# EAGLE design pov (EAGLE 5.11)
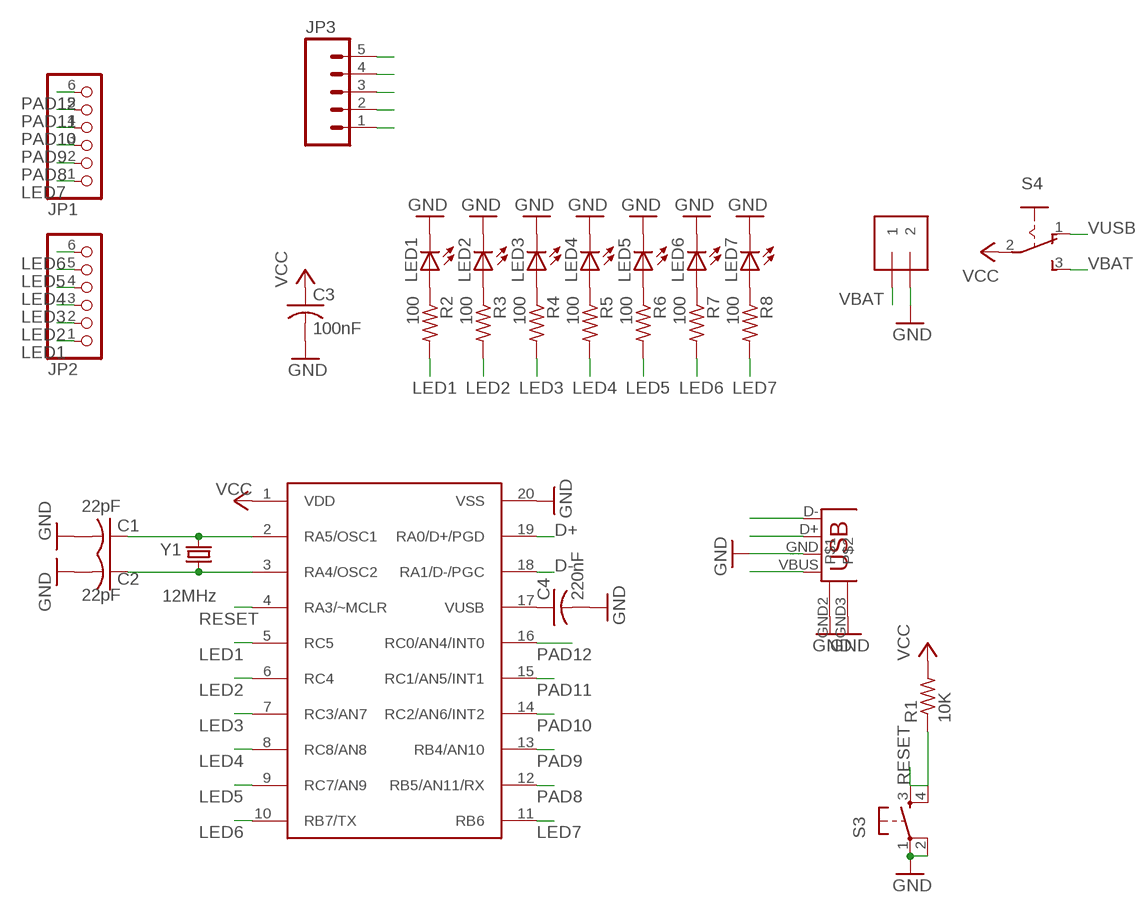
[diagram p0: schematic, sheet 1]

## Parts
C1  22pF  C-US025-025X050  [C025-025X050]
C2  22pF  C-US025-025X050  [C025-025X050]
C3  100nF  C-US025-025X050  [C025-025X050]
C4  220nF  C-US025-025X050  [C025-025X050]
J1  1X2-3.5MM  [1X2-3.5MM]
JP1  PINHD-1X6B  [1X06-BIG]
JP2  PINHD-1X6B  [1X06-BIG]
JP3  M05PTH  [1X05]
LED1  LED5MM  [LED5MM]
LED2  LED5MM  [LED5MM]
LED3  LED5MM  [LED5MM]
LED4  LED5MM  [LED5MM]
LED5  LED5MM  [LED5MM]
LED6  LED5MM  [LED5MM]
LED7  LED5MM  [LED5MM]
R1  10K  R-US_0204/7  [0204/7]
R2  100  R-US_0204/5  [0204/5]
R3  100  R-US_0204/5  [0204/5]
R4  100  R-US_0204/5  [0204/5]
R5  100  R-US_0204/5  [0204/5]
R6  100  R-US_0204/5  [0204/5]
R7  100  R-US_0204/5  [0204/5]
R8  100  R-US_0204/5  [0204/5]
S3  TAC_SWITCHPTH  [TACTILE-PTH]
S4  255SB  [255SB]
U$1  PIC18F14K50  [DIL20]
X1  USB-A-H  [USB-A-H]
Y1  12MHz  CRYSTALHC49UV  [HC49U-V]

## Nets
D+: JP3.2 U$1.19(RA0/D+/PGD) X1.D+(D-)
D-: JP3.1 U$1.18(RA1/D-/PGC) X1.D-(D+)
GND: C1.2 C2.2 C3.2 C4.2 J1.2 JP3.3 LED1.K(C) LED2.K(C) LED3.K(C) LED4.K(C) LED5.K(C) LED6.K(C) LED7.K(C) S3.1 S3.2 U$1.20(VSS) X1.GND2 X1.GND3 X1.GND(VBUS)
LED1: JP2.1 R2.2 U$1.5(RC5)
LED2: JP2.2 R3.2 U$1.6(RC4)
LED3: JP2.3 R4.2 U$1.7(RC3/AN7)
LED4: JP2.4 R5.2 U$1.8(RC8/AN8)
LED5: JP2.5 R6.2 U$1.9(RC7/AN9)
LED6: JP2.6 R7.2 U$1.10(RB7/TX)
LED7: JP1.1 R8.2 U$1.11(RB6)
N$1: C1.1 U$1.2(RA5/OSC1) Y1.2
N$2: C2.1 U$1.3(RA4/OSC2) Y1.1
N$3: C4.1 U$1.17(VUSB)
N$4: LED1.A R2.1
N$5: LED2.A R3.1
N$6: LED3.A R4.1
N$7: LED4.A R5.1
N$8: LED5.A R6.1
N$9: LED6.A R7.1
N$10: LED7.A R8.1
PAD8: JP1.2 U$1.12(RB5/AN11/RX)
PAD9: JP1.3 U$1.13(RB4/AN10)
PAD10: JP1.4 U$1.14(RC2/AN6/INT2)
PAD11: JP1.5 U$1.15(RC1/AN5/INT1)
PAD12: JP1.6 U$1.16(RC0/AN4/INT0)
RESET: JP3.5 R1.1 S3.3 S3.4 U$1.4(RA3/~MCLR)
VBAT: J1.1 S4.3(S)
VCC: C3.1 JP3.4 R1.2 S4.2(P) U$1.1(VDD)
VUSB: S4.1(O) X1.VBUS(GND)

## Library data of the parts
C1-C4 = adafruit:C-US: CAPACITOR, American symbol
J1 = adafruit:1X2: 3.5mm Terminal block http://www.ladyada.net/library/pcb/eaglelibrary.html
JP1 JP2 = adafruit:PINHD-1X6: PIN HEADER
JP3 = SparkFun:M05: Header 5 Standard 5-pin 0.1" header. Use with straight break away headers (SKU : PRT-00116), right angle break away headers (PRT-00553), swiss pins (PRT-00743), machine pins (PRT-00117), and female headers (PRT-00115). Molex polarized connector foot print use with SKU : PRT-08230 with associated crimp pins and housings.
LED1-LED7 = adafruit:LED: LED OSRAM: - CHIPLED LG R971, LG N971, LY N971, LG Q971, LY Q971, LO R971, LY R971 LH N974, LH R974 LS Q976, LO Q976, LY Q976 LO Q996 - Hyper CHIPLED LW Q18S LB Q993, LB Q99A, LB R99A - SideLED LS A670, LO A670, LY A670, LG A670, LP A670 LB A673, LV A673, LT A673, LW A673 LH A674 LY A675 LS A676, LA A676, LO A676, LY A676, LW A676 LS A679, LY A679, LG A679 - Hyper Micro SIDELED® LS Y876, LA Y876, LO Y876, LY Y876 LT Y87S - SmartLED LW L88C, LW L88S LB L89C, LB L89S, LG L890 LS L89K, LO L89K, LY L89K LS L896, LA L896, LO L896, LY L896 - TOPLED LS T670, LO T670, LY T670, LG T670, LP T670 LSG T670, LSP T670, LSY T670, LOP T670, LYG T670 LG T671, LOG T671, LSG T671 LB T673, LV T673, LT T673, LW T673 LH T674 LS T676, LA T676, LO T676, LY T676, LB T676, LH T676, LSB T676, LW T676 LB T67C, LV T67C, LT T67C, LS T67K, LO T67K, LY T67K, LW E67C LS E67B, LA E67B, LO E67B, LY E67B, LB E67C, LV E67C, LT E67C LW T67C LS T679, LY T679, LG T679 LS T770, LO T770, LY T770, LG T770, LP T770 LB T773, LV T773, LT T773, LW T773 LH T774 LS E675, LA E675, LY E675, LS T675 LS T776, LA T776, LO T776, LY T776, LB T776 LHGB T686 LT T68C, LB T68C - Hyper Mini TOPLED® LB M676 - Mini TOPLED Santana® LG M470 LS M47K, LO M47K, LY M47K Source: http://www.osram.convergy.de/
R1-R8 = adafruit:R-US_: RESISTOR, American symbol
S3 = SparkFun:TAC_SWITCH: Momentary Switch Button commonly used for reset or general input. Spark Fun Electronics SKU : COM-00097
S4 = switch:255SB: SLIDING SWITCH Distributor Buerklin, 11G810
U$1 = pedrodiogo:PIC18F14K50: Microchip PIC18F14K50 DATASHEET: http://ww1.microchip.com/downloads/en/DeviceDoc/41350E.pdf
X1 = pedrodiogo:USB: USB Connectors USB-B-PTH is fully proven SKU : PRT-00139 USB-miniB is fully proven SKU : PRT-00587 USB-A-PCB is untested. USB-A-H is throughly reviewed, but untested. Spark Fun Electronics SKU : PRT-00437 USB-B-SMT is throughly reviewed, but untested. Needs silkscreen touching up. USB-A-S has not been used/tested USB-MB-H has not been used/tested
Y1 = SparkFun:CRYSTAL: Crystals Various standard crystals. Proven footprints. Spark Fun Electronics SKU : COM-00534

## Board
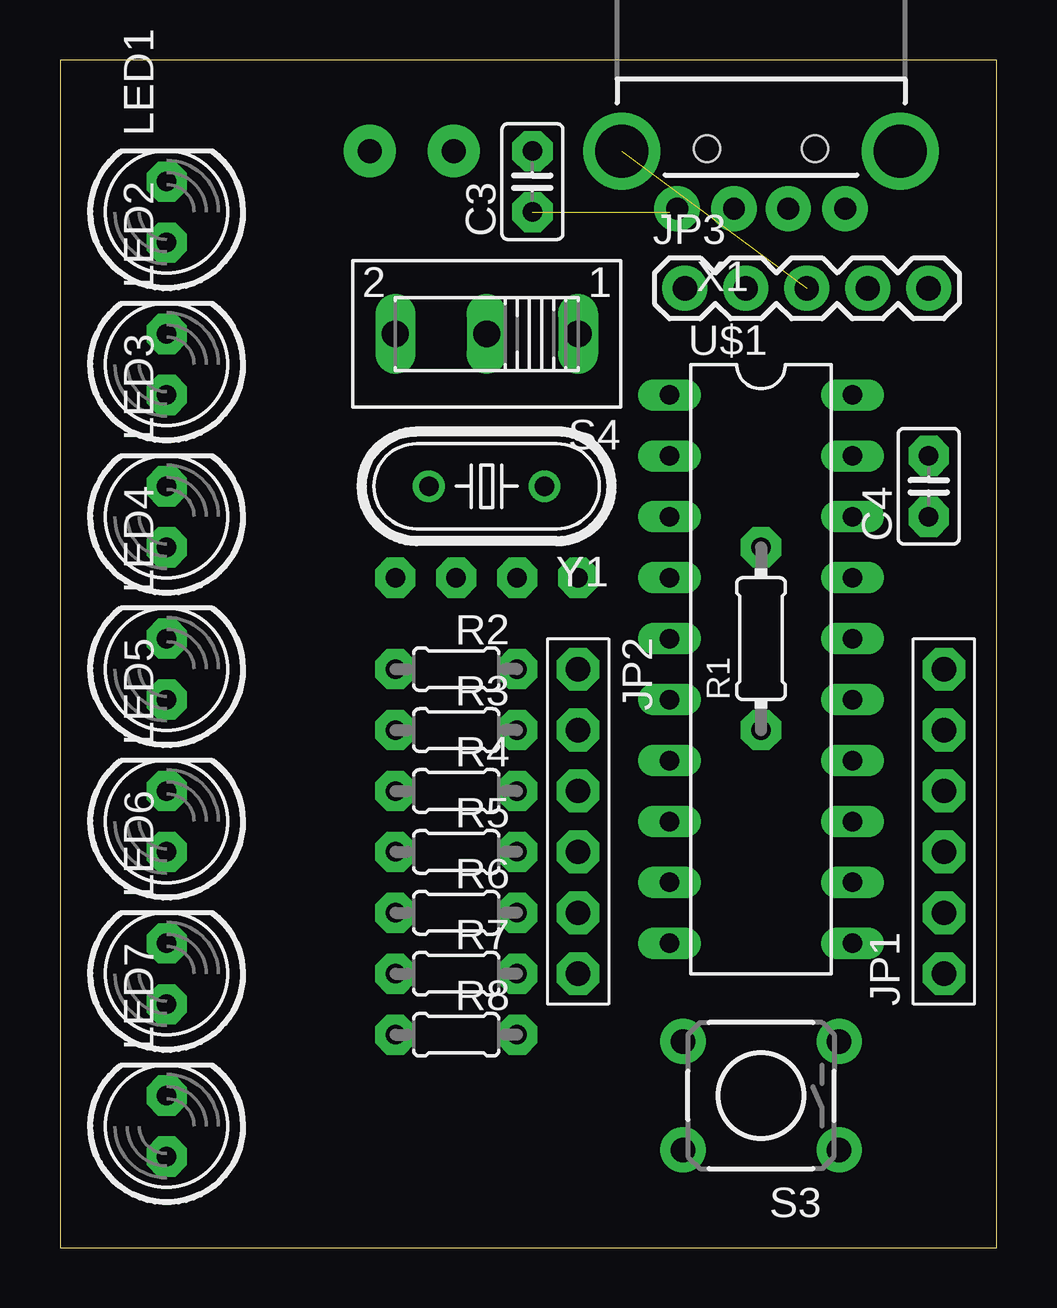
[diagram p1: board, top side]
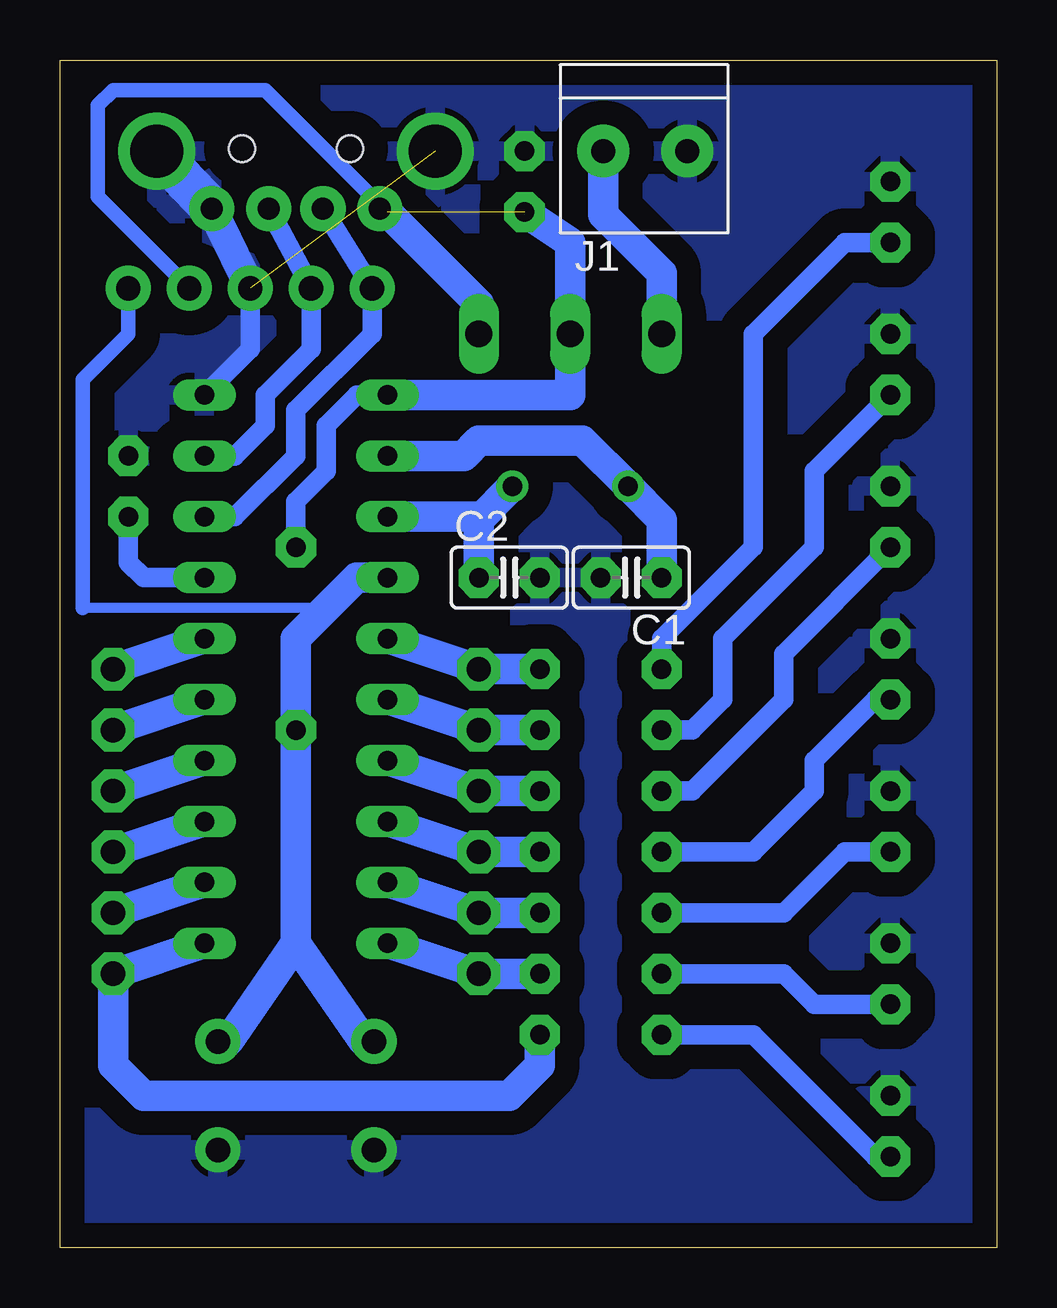
[diagram p2: board, bottom side, seen from below]

Size 39.04 x 49.52 mm. Coordinates in mm from the lower left corner, seen from the top.
Outline: 0,0 39.04,0 39.04,49.52 0,49.52 0,0
Copper layers (1*16): Top 0.035mm / dielectric 1.5mm / Bottom 0.035mm
Design rules "default *": minimum track width 16mil, minimum drill 24mil, track to track 40mil, track to pad 18mil, pad to pad 12mil, via to via 8mil, smd to smd 8mil, copper to edge 40mil, drill to drill 8mil, minimum pad ring 10mil, minimum via ring 8mil, stop-mask expansion 4mil, vias tented up to drill 0mil, thermal gap 10mil

### Footprints (pad centres in the part's own frame; a part is rotated, then mirrored left to right if it is on the bottom)
C025-025X050 = drill 0.813 pad 1.676 octagon: 1 -1.27,0; 2 1.27,0
1X2-3.5MM = drill 1 pad 2.184 round: 1 1.8,0; 2 -1.7,0
1X06-BIG = drill 1.016 pad 1.778 octagon: 1 -6.35,0; 2 -3.81,0; 3 -1.27,0; 4 1.27,0; 5 3.81,0; 6 6.35,0
1X05 = drill 1.016 pad 1.88 round: 1 0,0; 2 2.54,0; 3 5.08,0; 4 7.62,0; 5 10.16,0
LED5MM = drill 0.813 pad 1.676 octagon: A -1.27,0; K 1.27,0
0204/7 = drill 0.813 pad 1.676 octagon: 1 -3.81,0; 2 3.81,0
0204/5 = drill 0.813 pad 1.676 octagon: 1 -2.54,0; 2 2.54,0
TACTILE-PTH = drill 1.016 pad 1.88 round: 1 -3.251,2.261; 2 3.251,2.261; 3 -3.251,-2.261; 4 3.251,-2.261
255SB = drill 1.118 long: 1 -3.81,0; 2 0,0; 3 3.81,0
DIL20 = drill 0.813 long: 1 -11.43,-3.81; 2 -8.89,-3.81; 3 -6.35,-3.81; 4 -3.81,-3.81; 5 -1.27,-3.81; 6 1.27,-3.81; 7 3.81,-3.81; 8 6.35,-3.81; 9 8.89,-3.81; 10 11.43,-3.81; 11 11.43,3.81; 12 8.89,3.81; 13 6.35,3.81; 14 3.81,3.81; 15 1.27,3.81; 16 -1.27,3.81; 17 -3.81,3.81; 18 -6.35,3.81; 19 -8.89,3.81; 20 -11.43,3.81
USB-A-H = drill 0.914 pad 1.88 round: D+ 2.4,1.127; D- 2.4,-1.127; GND 2.4,3.5; VBUS 2.4,-3.5 | drill 2.2 round: GND2 0,-5.8; GND3 0,5.8 | hole 1.1: -0.1,2.25; -0.1,-2.25
HC49U-V = drill 0.813 round: 1 -2.413,0; 2 2.413,0

### Placement (x,y rotation side)
C1  15.24,27.94 180 bottom
C2  20.32,27.94 0 bottom
C3  19.68,44.45 90 top
C4  36.2,31.75 90 top
J1  14.61,45.72 180 bottom
JP1  36.83,17.78 90 top
JP2  21.59,17.78 270 top
JP3  26.04,40 0 top
LED1  4.45,43.18 90 top
LED2  4.45,36.83 90 top
LED3  4.45,30.48 90 top
LED4  4.45,24.13 90 top
LED5  4.45,17.78 90 top
LED6  4.45,11.43 90 top
LED7  4.45,5.08 90 top
R1  29.21,25.4 90 top
R2  16.51,24.13 0 top
R3  16.51,21.59 0 top
R4  16.51,19.05 0 top
R5  16.51,16.51 0 top
R6  16.51,13.97 0 top
R7  16.51,11.43 0 top
R8  16.51,8.89 0 top
S3  29.21,6.35 180 top
S4  17.78,38.1 180 top
U$1  29.21,24.13 270 top
X1  29.21,45.72 270 top
Y1  17.78,31.75 180 top

### Tracks (layer width: path | path; a pad name or v marks a point on that pad's centre or on a via)
D+
  Bottom 0.813: X1.D+ JP3.2 28.57,37.46 30.48,35.56 30.48,34.29 31.75,33.02 U$1.19
D-
  Bottom 0.813: X1.D- JP3.1 26.04,38.1 29.21,34.92 29.21,33.02 31.75,30.48 U$1.18
GND  (1 unrouted)
  Bottom 0.813: JP3.3 31.11,37.46 U$1.20
  Bottom 1.27: 32.85,43.18 X1.GND JP3.3
  Bottom 1.778: X1.GND X1.GND3
  pour Bottom: 1.27,48.26 38.1,48.26 38.1,1.27 1.27,1.27
LED1
  Bottom 1.27: U$1.5 JP2.1 R2.2
LED2
  Bottom 1.27: U$1.6 JP2.2 R3.2
LED3
  Bottom 1.27: R4.2 JP2.3 U$1.7
LED4
  Bottom 1.27: R5.2 JP2.4 U$1.8
LED5
  Bottom 1.27: R6.2 JP2.5 U$1.9
LED6
  Bottom 1.27: R7.2 JP2.6 U$1.10
LED7
  Bottom 1.27: U$1.11 JP1.1 36.83,7.62 35.56,6.35 20.32,6.35 19.05,7.62 R8.2
N$1
  Bottom 1.27: C1.1 13.97,30.35 Y1.2 17.27,33.66 21.59,33.66 22.23,33.02 U$1.2
N$2
  Bottom 0.813: 21.59,30.35 21.72,30.48
  Bottom 1.27: C2.1 21.59,30.35 Y1.1 | 21.72,30.48 U$1.3
N$3
  Bottom 0.813: C4.1 36.2,28.57 35.56,27.94 U$1.17
N$4
  Bottom 0.813: R2.1 13.97,25.4 10.16,29.21 10.16,38.1 6.35,41.91 LED1.A
N$5
  Bottom 0.813: R3.1 12.7,21.59 11.43,22.86 11.43,25.4 7.62,29.21 7.62,32.39 LED2.A
N$6
  Bottom 0.813: R4.1 12.7,19.05 8.89,22.86 8.89,24.76 LED3.A
N$7
  Bottom 0.813: R5.1 10.16,16.51 7.62,19.05 7.62,20.32 5.08,22.86 LED4.A
N$8
  Bottom 0.813: R6.1 8.89,13.97 6.35,16.51 LED5.A
N$9
  Bottom 0.813: R7.1 8.89,11.43 7.62,10.16 LED6.A
N$10
  Bottom 0.813: R8.1 10.16,8.89 5.08,3.81 LED7.A
PAD8
  Bottom 1.27: JP1.2 U$1.12
PAD9
  Bottom 1.27: JP1.3 U$1.13
PAD10
  Bottom 1.27: JP1.4 U$1.14
PAD11
  Bottom 1.27: JP1.5 U$1.15
PAD12
  Bottom 1.27: JP1.6 U$1.16
RESET
  Bottom 0.406: 27.94,26.67 38.1,26.67
  Bottom 0.61: JP3.5 36.2,38.1 38.1,36.19 38.1,26.67
  Bottom 0.813: S3.4 26.39,8.61 | 32.03,8.61 S3.3
  Bottom 1.27: 26.67,27.94 29.21,25.4 R1.1 29.21,12.7 | 26.67,27.94 U$1.4 | 26.39,8.61 29.21,12.7 | 29.21,12.7 32.03,8.61 | 26.67,27.94 27.94,26.67
VBAT
  Bottom 1.27: J1.1 16.41,43.08 13.97,40.64 S4.3
VCC  (1 unrouted)
  Bottom 0.61: JP3.4 37.47,43.81 37.47,47.62 36.83,48.26 30.48,48.26 25.4,43.18
  Bottom 0.813: R1.2 29.21,31.11 27.94,32.39 27.94,34.29 26.67,35.56 U$1.1
  Bottom 1.27: U$1.1 17.78,35.56 S4.2 17.78,41.91 C3.1
VUSB
  Bottom 1.016: 25.4,43.18 25.57,43.18 X1.VBUS
  Bottom 1.27: S4.1 21.59,39.37 25.4,43.18